# EasyEDA Pro project Amplifier Module D.eprj

# Schematic Schematic1
Create Date: 2024-02-14; Page Name: P1; Project Name: Amplifier Module D; Schematic Name: Schematic1; Update Date: 2024-05-11; Company: EasyEDA.com; Drawn: EasyEDA; Page Size: A4; Part Number: JLCPCB-002; Reviewed: EasyEDA; Version: V0.1
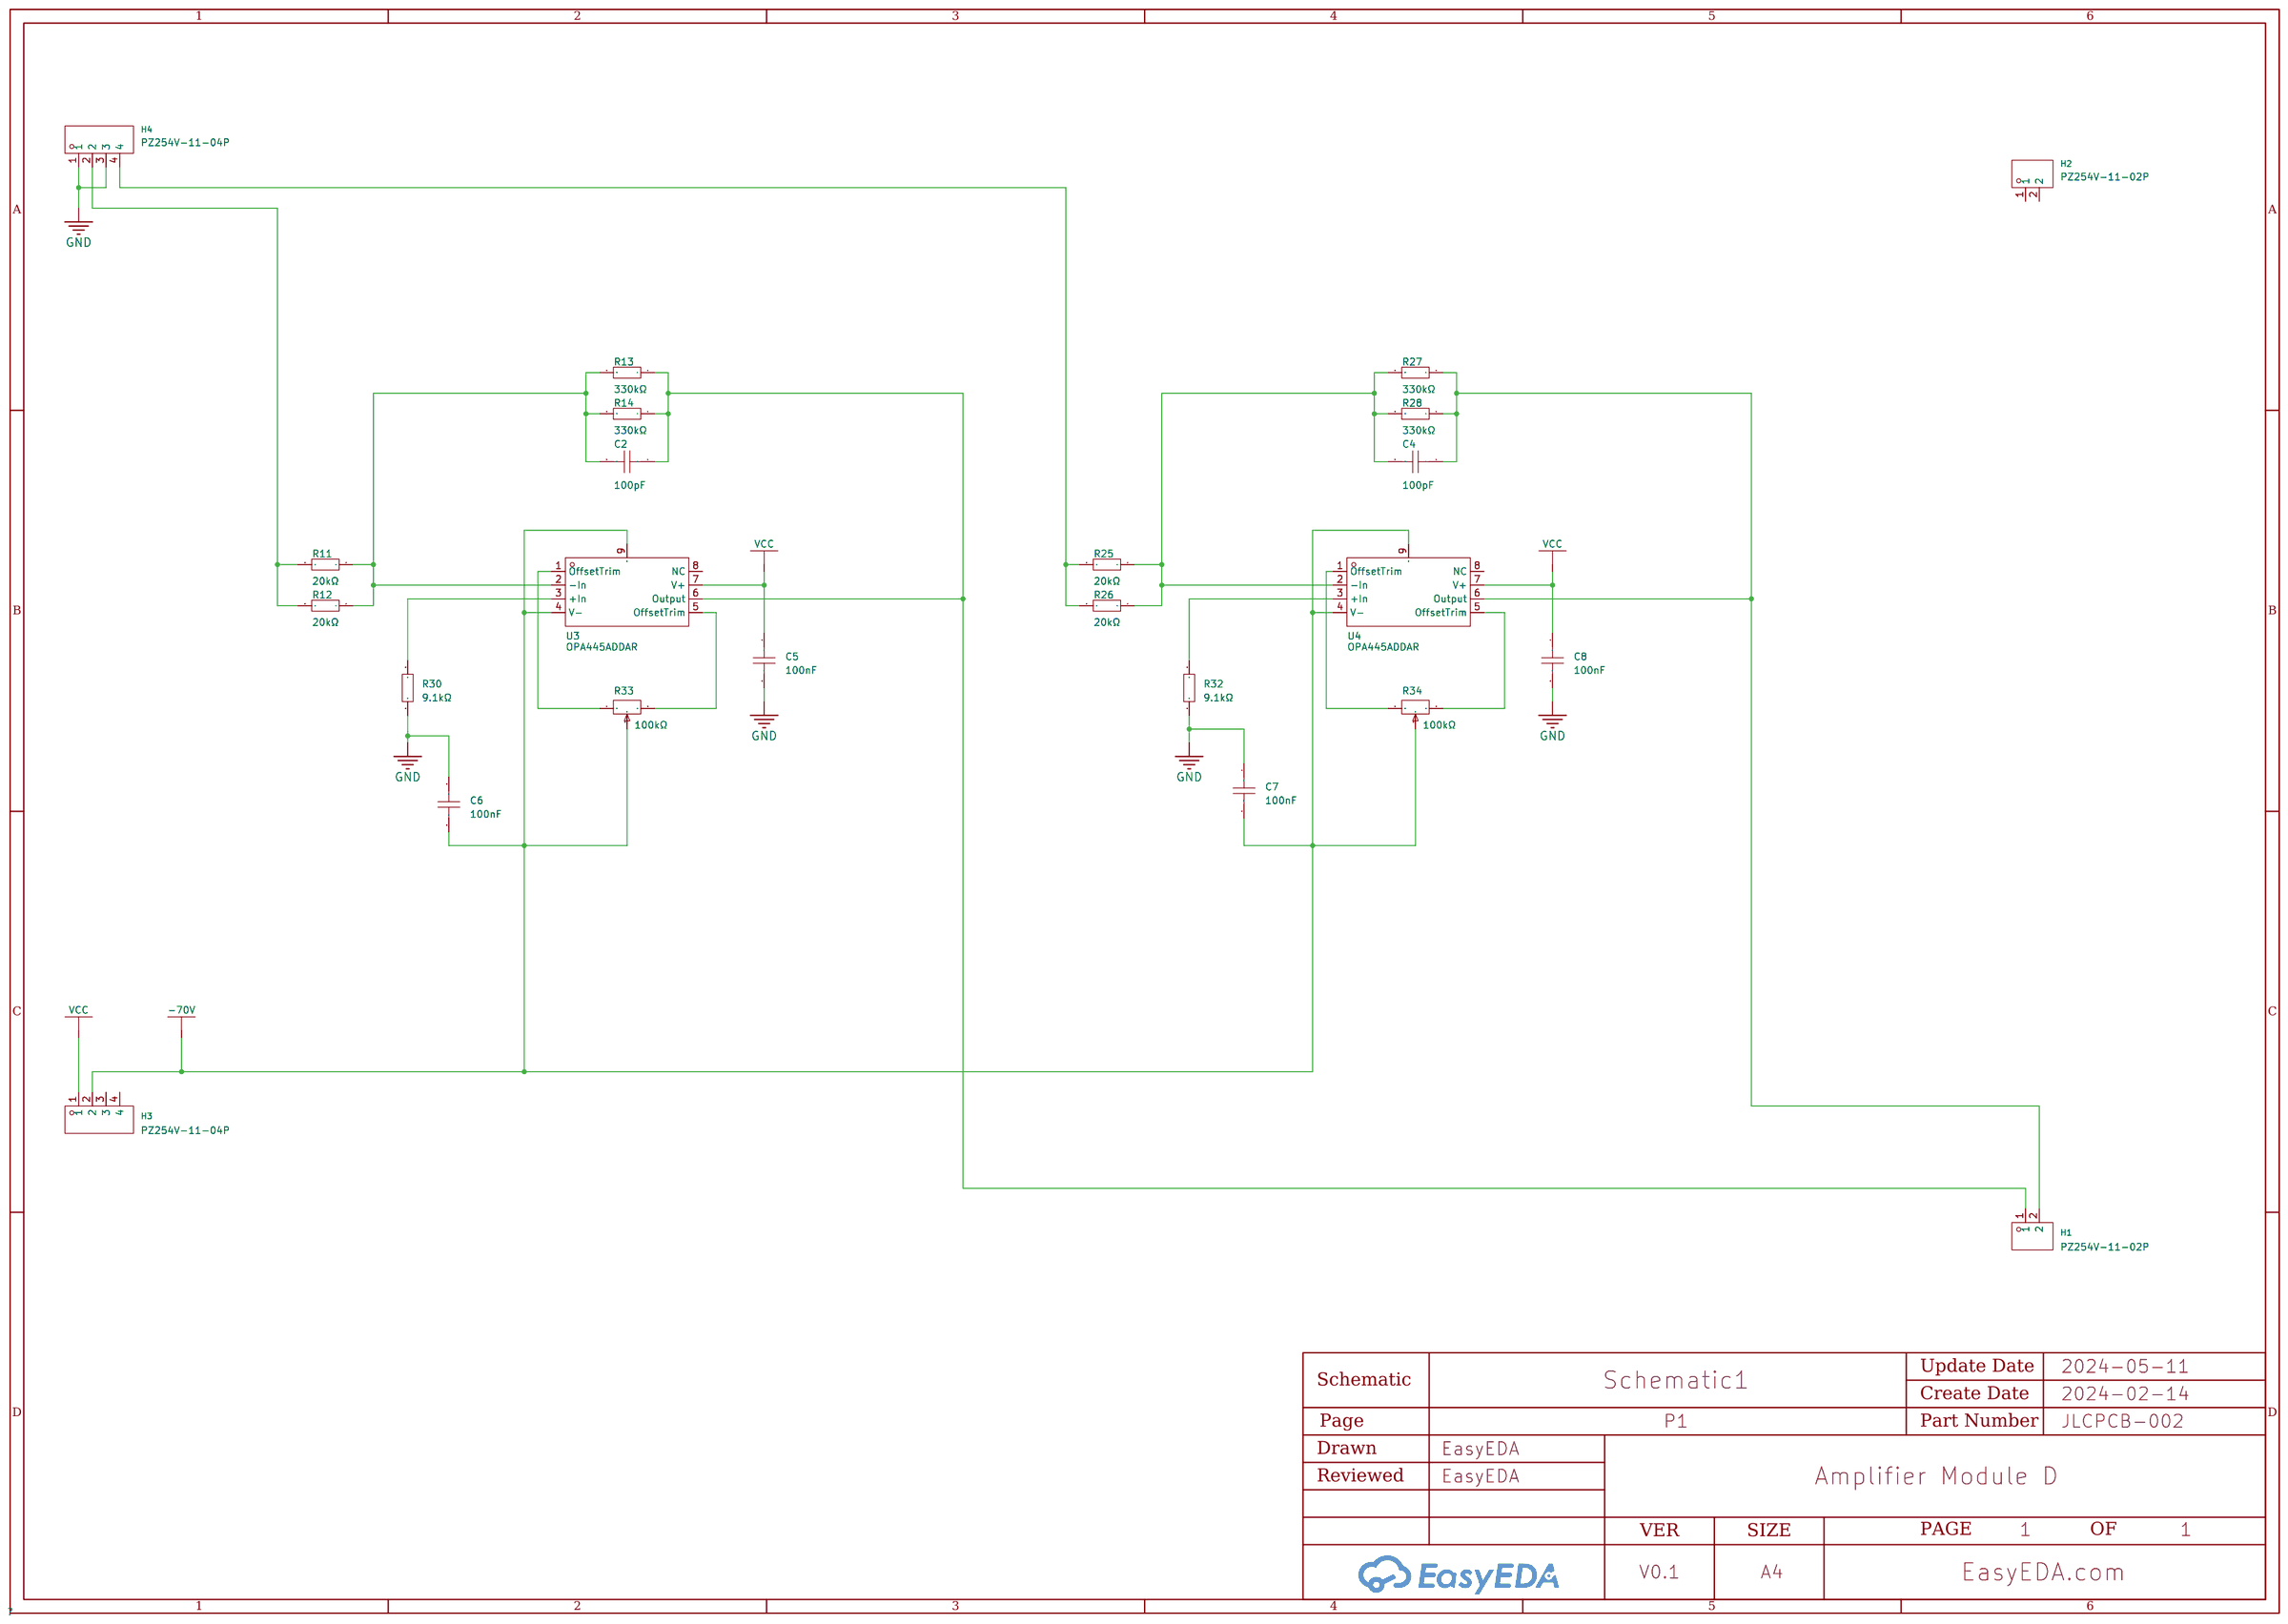
[diagram p0: schematic sheet]

## Parts
C2  100pF  [C0603]
C4  100pF  [C0603]
C5  100nF  [C0603]
C6  100nF  [C0603]
C7  100nF  [C0603]
C8  100nF  [C0603]
H1  PZ254V-11-02P  [HDR-TH_2P-P2.54-V-M]  (no BOM)
H2  PZ254V-11-02P  [HDR-TH_2P-P2.54-V-M]  (no BOM)
H3  PZ254V-11-04P  [HDR-TH_4P-P2.54-V-M]  (no BOM)
H4  PZ254V-11-04P  [HDR-TH_4P-P2.54-V-M]  (no BOM)
R11  20kΩ  [R0603]
R12  20kΩ  [R0603]
R13  330kΩ  [R0603]
R14  330kΩ  [R0603]
R25  20kΩ  [R0603]
R26  20kΩ  [R0603]
R27  330kΩ  [R0603]
R28  330kΩ  [R0603]
R30  9.1kΩ  [R0603]
R32  9.1kΩ  [R0603]
R33  100kΩ  [RES-ADJ-TH_3296W]  (no BOM)
R34  100kΩ  [RES-ADJ-TH_3296W]  (no BOM)
U3  OPA445ADDAR  [POWERPAD-SO-8_L4.9-W3.9-P1.27-LS6.0-BL-EP]
U4  OPA445ADDAR  [POWERPAD-SO-8_L4.9-W3.9-P1.27-LS6.0-BL-EP]

## Library data of the parts
C2 C4 = 0603CG101J101NT: Capacitance: Tolerance:±5% Tolerance:±5% Voltage Rated: Temperature Coefficient:; LCSC Part Name: 100pF ±5% 100V; Supplier Part: C44567; Manufacturer: FH(风华); Supplier Footprint: 0603; JLCPCB Part Class: Extended Part; Datasheet: https://atta.szlcsc.com/upload/public/pdf/source/20200305/C486355_26A10D38EF8C2A5C37091D0039909270.pdf; Supplier: LCSC; Tolerance: ±5%
C5-C8 = 0603B104K101NT: Capacitance:100nF Tolerance:±10% Tolerance:±10% Voltage Rated: Temperature Coefficient:; LCSC Part Name: 100nF ±10% 100V; Supplier Part: C88219; Manufacturer: FH(风华); Supplier Footprint: 0603; JLCPCB Part Class: Extended Part; Datasheet: https://atta.szlcsc.com/upload/public/pdf/source/20200305/C486355_26A10D38EF8C2A5C37091D0039909270.pdf; Supplier: LCSC; Tolerance: ±10%
H1 H2 = PZ254V-11-02P: Pin Structure:1x2P Pitch:2.54mm Row Spacing:- Circluar Pins/Square Pins:Square Pins Mounting Type:Straight Number of Rows:Plugin Number of Pins:2P Current Rating (Max):- Voltage Rating (Max):- Length of Mating Pin:6mm Insulation Height:2.5mm Length of End; LCSC Part Name: 间距:2.54mm 1x2P 直插 方针; Supplier Part: C492401; Manufacturer: XFCN(兴飞); Supplier Footprint: 插件,P=2.54mm; JLCPCB Part Class: Extended Part; Datasheet: https://atta.szlcsc.com/upload/public/pdf/source/20200309/C492401_A812433581A9B211A7FFA413ADDFF0E5.pdf; Supplier: LCSC; Pin Structure: 1x2P; Pitch: 2.54mm; Circluar Pins/Square Pins: Square Pins; Mounting Type: Straight; Number of Rows: Plugin; Number of Pins: 2P; Length of Mating Pin: 6mm; Insulation Height: 2.5mm; Length of End Connection Pin: 3mm; Operating Temperature Range: -40℃~+105℃; Color: Black
H3 H4 = PZ254V-11-04P: Pin Structure:1x4P Pitch:2.54mm Row Spacing:- Circluar Pins/Square Pins:Square Pins Mounting Type:Straight Number of Rows:Plugin Number of Pins:4P Current Rating (Max):3A Voltage Rating (Max):250V Length of Mating Pin:6mm Insulation Height:2.5mm Length of; LCSC Part Name: 间距:2.54mm 1x4P 直插 方针; Supplier Part: C2691448; Manufacturer: XFCN(兴飞); Supplier Footprint: 插件,P=2.54mm; JLCPCB Part Class: Extended Part; Datasheet: https://atta.szlcsc.com/upload/public/pdf/source/20200309/C492403_F9F19131791D08044AD4F84F8E751A34.pdf; Supplier: LCSC; Pin Structure: 1x4P; Pitch: 2.54mm; Circluar Pins/Square Pins: Square Pins; Mounting Type: Straight; Number of Rows: Plugin; Number of Pins: 4P; Current Rating (Max): 3A; Voltage Rating (Max): 250V; Length of Mating Pin: 6mm; Insulation Height: 2.5mm; Length of End Connection Pin: 3mm; Operating Temperature Range: -40℃~+105℃; Color: Black
R11 R12 R25 R26 = 0603WAF2002T5E: Type:Thick Film Resistors Resistance:20kΩ Tolerance:±1% Tolerance:±1% Power(Watts): Overload Voltage (Max): Temperature Coefficient:±100ppm/℃ Temperature Coefficient:±100ppm/℃ Operating Temperature Range:-55℃~+155℃ Operating Temperature Range:-55℃~+155℃; LCSC Part Name: 20kΩ ±1% 100mW 厚膜电阻; Supplier Part: C4184; Manufacturer: UNI-ROYAL(厚声); Supplier Footprint: 0603; JLCPCB Part Class: Basic Part; Datasheet: https://atta.szlcsc.com/upload/public/pdf/source/20200306/C422600_1E6D84923E4A46A82E41ADD87F860B5C.pdf; Supplier: LCSC; Type: Thick Film Resistors; Tolerance: ±1%; Temperature Coefficient: ±100ppm/℃; Operating Temperature Range: -55℃~+155℃
R13 R14 R27 R28 = 0603WAF3303T5E: Type:Thick Film Resistors Resistance:330kΩ Tolerance:±1% Tolerance:±1% Power(Watts): Overload Voltage (Max): Temperature Coefficient:±100ppm/℃ Temperature Coefficient:±100ppm/℃ Operating Temperature Range:-55℃~+155℃ Operating Temperature Range:-55℃~+155℃; LCSC Part Name: 330kΩ ±1% 100mW 厚膜电阻; Supplier Part: C23137; Manufacturer: UNI-ROYAL(厚声); Supplier Footprint: 0603; JLCPCB Part Class: Basic Part; Datasheet: https://atta.szlcsc.com/upload/public/pdf/source/20200306/C422600_1E6D84923E4A46A82E41ADD87F860B5C.pdf; Supplier: LCSC; Type: Thick Film Resistors; Tolerance: ±1%; Temperature Coefficient: ±100ppm/℃; Operating Temperature Range: -55℃~+155℃
R30 R32 = 0603WAF9101T5E: Type:Thick Film Resistors Resistance:9.1kΩ Tolerance:±1% Tolerance:±1% Power(Watts): Overload Voltage (Max): Temperature Coefficient:±100ppm/℃ Temperature Coefficient:±100ppm/℃ Operating Temperature Range:-55℃~+155℃ Operating Temperature Range:-55℃~+155℃; LCSC Part Name: 9.1kΩ ±1% 100mW 厚膜电阻; Supplier Part: C23260; Manufacturer: UNI-ROYAL(厚声); Supplier Footprint: 0603; JLCPCB Part Class: Basic Part; Datasheet: https://atta.szlcsc.com/upload/public/pdf/source/20200306/C422600_1E6D84923E4A46A82E41ADD87F860B5C.pdf; Supplier: LCSC; Type: Thick Film Resistors; Tolerance: ±1%; Temperature Coefficient: ±100ppm/℃; Operating Temperature Range: -55℃~+155℃
R33 R34 = 3296W-1-104LF: Resistance: Tolerance:±10% Tolerance:±10% Power(Watts): Temperature Coefficient:±100ppm/℃ Temperature Coefficient:±100ppm/℃ Turns:; LCSC Part Name: 100kΩ ±10%; Supplier Part: C48084; Manufacturer: BOURNS; Supplier Footprint: 插件; JLCPCB Part Class: Extended Part; Datasheet: https://atta.szlcsc.com/upload/public/pdf/source/20151026/1457707506403.pdf; Supplier: LCSC; Tolerance: ±10%; Temperature Coefficient: ±100ppm/℃
U3 U4 = OPA445ADDAR: Number of Circuits:单路 Gain Bandwidth Product(GBP):2MHz Current - Input Bias(Ib):10pA Slew Rate(SR):15V/us Output Current:15mA -3db Bandwidth:- Operating Temperature:-25℃~+85℃ Operating Temperature:-25℃~+85℃; Supplier Part: C1348607; Manufacturer: TI(德州仪器); Supplier Footprint: Power-Pad-SO-8; JLCPCB Part Class: Extended Part; Datasheet: https://www.ti.com/cn/lit/gpn/opa445; Supplier: LCSC; Number of Circuits: 单路; Gain Bandwidth Product(GBP): 2MHz; Current - Input Bias(Ib): 10pA; Slew Rate(SR): 15V/us; Output Current: 15mA; Operating Temperature: -25℃~+85℃

## Nets
-70V: C6.2 C7.2 H3.2 R33.2 R34.2 U3.4(V-) U3.9(EP) U4.4(V-) U4.9(EP)
GND: C5.2 C6.1 C7.1 C8.2 H4.1 H4.3 R30.1 R32.1
VCC: C5.1 C8.1 H3.1 U3.7(V+) U4.7(V+)
$1N1603: C2.2 R11.1 R12.1 R13.2 R14.2 U3.2(-In)
$1N4259: H4.2 R11.2 R12.2
$1N6394: H4.4 R25.2 R26.2
$1N18673: R30.2 U3.3(+In)
$1N21981: C2.1 H1.1 R13.1 R14.1 U3.6(Output)
$1N22006: R33.3 U3.5(OffsetTrim)
$1N22014: R33.1 U3.1(OffsetTrim)
$1N22193: C4.1 H1.2 R27.1 R28.1 U4.6(Output)
$1N22195: R34.3 U4.5(OffsetTrim)
$1N22199: R34.1 U4.1(OffsetTrim)
$1N22249: R32.2 U4.3(+In)
$1N22253: C4.2 R25.1 R26.1 R27.2 R28.2 U4.2(-In)

Not connected (* = marked no-connect by the designer): H2 1 2; H3 3 4; U3 8(NC); U4 8(NC)

# Board PCB1
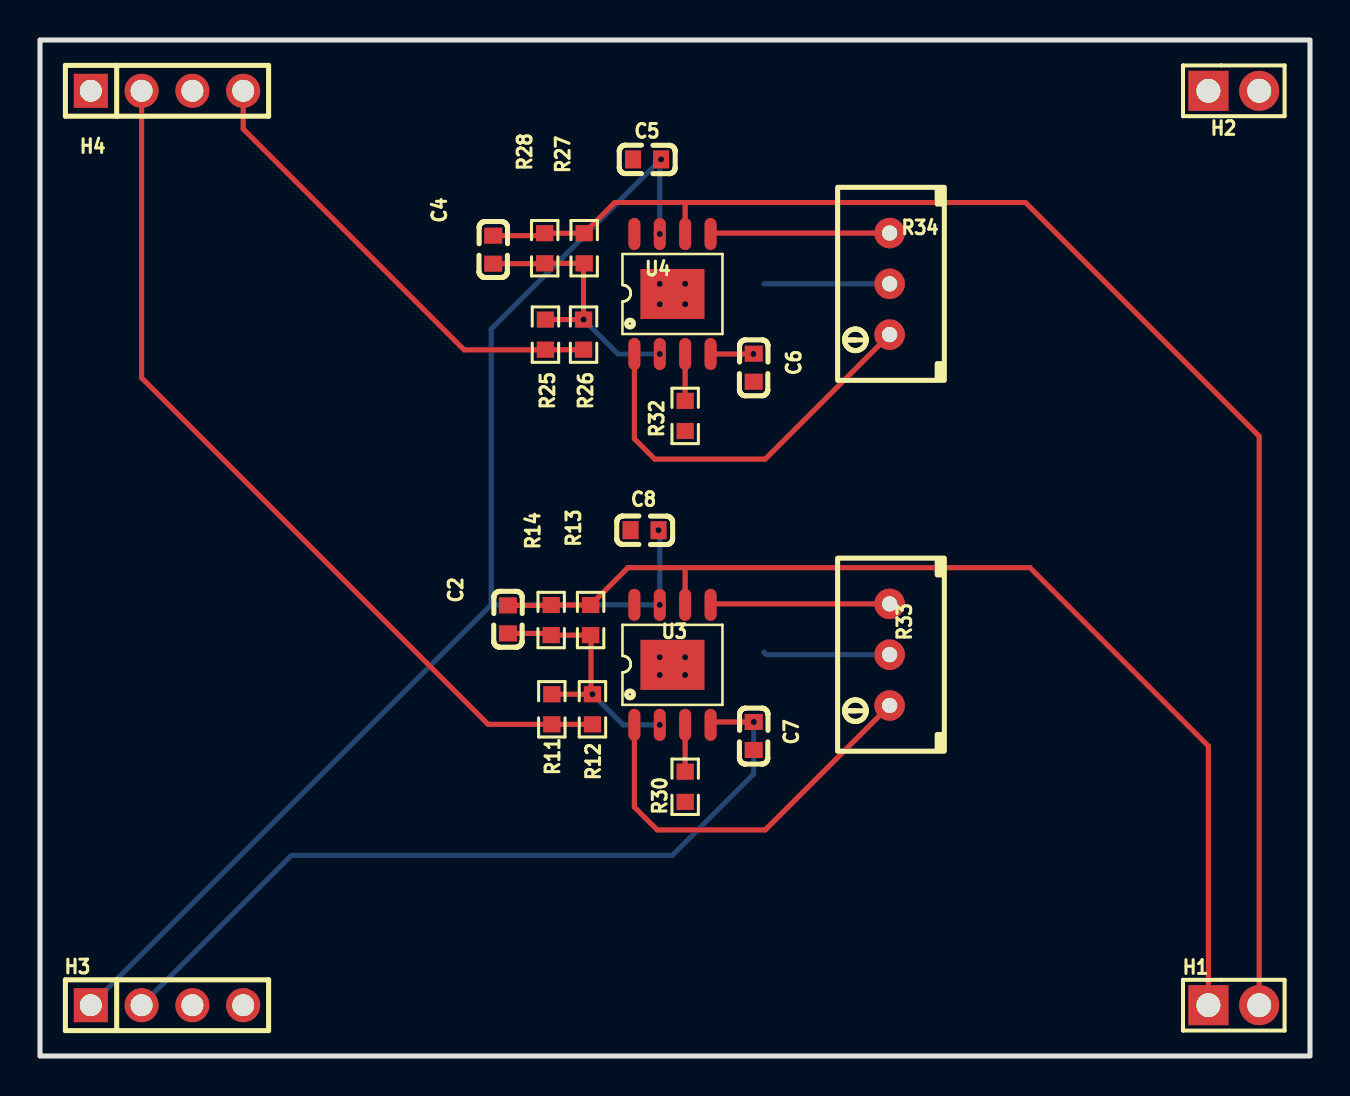
[diagram p1: board, top side]
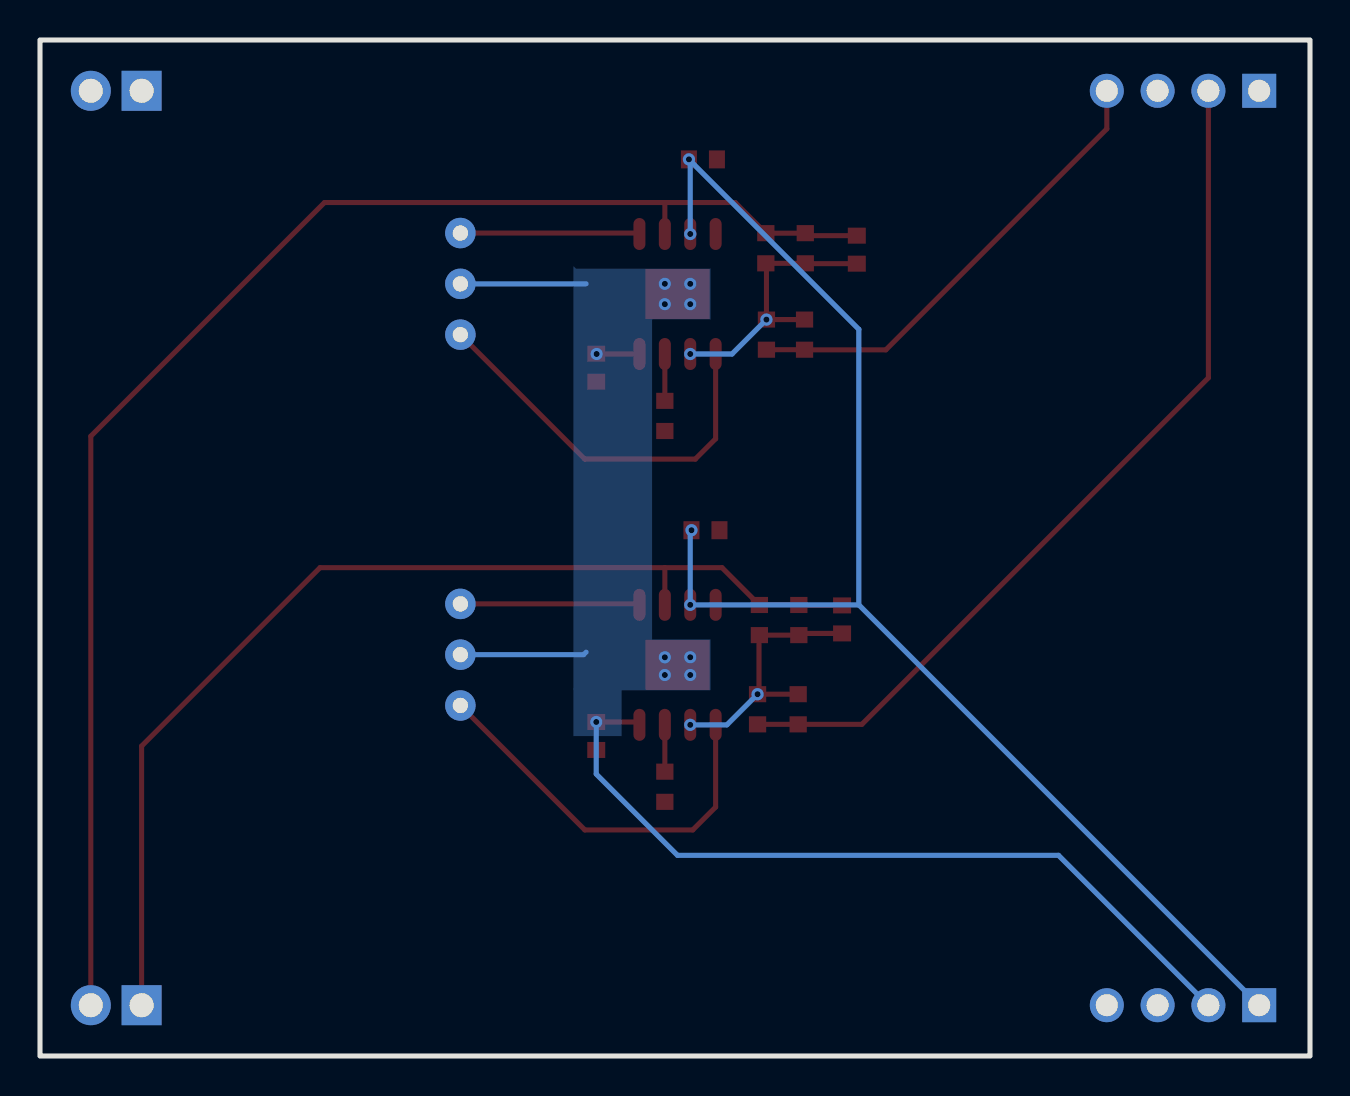
[diagram p2: board, bottom side, seen from below]

Outline 63.5 x 50.8 mm; copper layers: Top Layer, Bottom Layer. Coordinates in mm from the lower left corner of the outline.
Outline path: rectangle 0,50.8 63.5,0
Stack: Top Layer 0.035mm / Dielectric1 1.51mm FR4 er 4.5 / Bottom Layer 0.035mm

## Design rules (mm)
template: JLCPCB Capability(Two Layers Board)
spacing copperThickness1oz (default): track to track 0.102, other pairs 0.152 to 0.3
spacing copperThickness2oz: track to track 0.203, other pairs 0.152 to 0.3
track width copperThickness1oz (default): min 0.127, default 0.254, max 2.54
track width copperThickness2oz: min 0.203, default 0.254, max 2.54
differential pair differentialPair (default): width min 0.127, default 0.254, max 2.54; gap min 0.152, default 0.152
via viaSize (default): diameter min 0.5, default 0.61, max 10; hole min 0.3, default 0.305, max 6.3

## Placement (name value [footprint] x y rotation side)
C2  100pF  [C0603]  23.4 21.83 270 top
C4  100pF  [C0603]  22.66 40.32 270 top
C5  100nF  [C0603]  30.35 44.83 180 top
C6  100nF  [C0603]  35.69 34.42 90 top
C7  100nF  [C0603]  35.69 16 90 top
C8  100nF  [C0603]  30.23 26.29 180 top
H1  PZ254V-11-02P  [HDR-TH_2P-P2.54-V-M]  59.69 2.54 0 top
H2  PZ254V-11-02P  [HDR-TH_2P-P2.54-V-M]  59.69 48.26 0 top
H3  PZ254V-11-04P  [HDR-TH_4P-P2.54-V-M]  6.35 2.54 0 top
H4  PZ254V-11-04P  [HDR-TH_4P-P2.54-V-M]  6.35 48.26 0 top
R11  20kΩ  [R0603]  25.59 17.34 270 top
R12  20kΩ  [R0603]  27.62 17.34 270 top
R13  330kΩ  [R0603]  27.53 21.8 270 top
R14  330kΩ  [R0603]  25.56 21.8 270 top
R25  20kΩ  [R0603]  25.27 36.07 270 top
R26  20kΩ  [R0603]  27.18 36.07 270 top
R27  330kΩ  [R0603]  27.21 40.39 270 top
R28  330kΩ  [R0603]  25.24 40.39 270 top
R30  9.1kΩ  [R0603]  32.26 13.46 90 top
R32  9.1kΩ  [R0603]  32.26 32 90 top
R33  100kΩ  [RES-ADJ-TH_3296W]  42.48 20.07 180 top
R34  100kΩ  [RES-ADJ-TH_3296W]  42.48 38.61 180 top
U3  OPA445ADDAR  [POWERPAD-SO-8_L4.9-W3.9-P1.27-LS6.0-BL-EP]  31.62 19.56 0 top
U4  OPA445ADDAR  [POWERPAD-SO-8_L4.9-W3.9-P1.27-LS6.0-BL-EP]  31.62 38.1 0 top

## Footprints (pads in the part's own frame, mm; a bottom-side part is the same pattern mirrored in y, then rotated)
C0603
  rect 0.8x0.9 smd: 1(-0.7,0) 2(0.7,0)
HDR-TH_2P-P2.54-V-M
  rect 2x2 hole 1.2: 1(-1.27,0)
  round 2 hole 1.2: 2(1.27,0)
HDR-TH_4P-P2.54-V-M
  rect 1.7x1.7 hole 1.1: 1(-3.81,0)
  round 1.7 hole 1.1: 2(-1.27,0) 3(1.27,0) 4(3.81,0)
POWERPAD-SO-8_L4.9-W3.9-P1.27-LS6.0-BL-EP
  oval 0.6x1.6 smd: 1(-1.905,-3) 2(-0.635,-3) 3(0.635,-3) 4(1.905,-3) 5(1.905,3) 6(0.635,3) 7(-0.635,3) 8(-1.905,3)
  rect 3.2x2.5 smd: 9(0,0)
R0603
  rect 0.806x0.864 smd: 1(-0.753,0) 2(0.753,0)
RES-ADJ-TH_3296W
  round 1.524 hole 0.762: 1(0,2.54) 2(0,0) 3(0,-2.54)

## Nets
As in the schematic.

Pads without a net: H2 1 2; H3 3 4; U3 8; U4 8

## Via types
v1: diameter 0.61, hole 0.305, Top Layer to Bottom Layer, 18 vias

## Routing (per net, layer and track width the routed paths; a pad name or vN(x,y) marks a point on that pad's centre or on a via; arc(x,y) is an arc through that point)
-70V: length 55.1
  Top Layer w0.254: U4.4 v1(35.67,35.1) C6.2 ; 35.69,16.76 v1(35.69,16.7) 33.67,16.7 U3.4
  Bottom Layer w0.254: 36.19,20.19 36.32,20.07 R33.2 ; H3.2 12.57,10.03 31.62,10.03 35.69,14.1 v1(35.69,16.7) ; R34.2 36.19,38.61
  vias: v1(30.99,38.61) v1(30.99,37.59) v1(30.99,19.94) v1(30.99,19.05) v1(32.26,38.61) v1(32.26,37.59) v1(32.26,19.94) v1(32.26,19.05)
VCC: length 70
  Bottom Layer w0.254: H3.1 22.56,22.56 ; 22.56,22.56 v1(30.99,22.56) 30.99,26.23 v1(30.93,26.29) ; 22.56,22.56 22.56,36.34 30.99,44.77 ; v1(30.99,41.1) 30.99,44.77 ; 30.99,44.77 v1(31.05,44.83)
$1N1603: length 13
  Top Layer w0.254: C2.2 25.47,21.13 R14.2 R13.2 27.55,21.03 27.55,18.09 ; 27.55,18.09 25.72,18.09 ; 27.55,18.09 v1(27.62,18.09)
  Bottom Layer w0.254: v1(27.62,18.09) 29.15,16.56 v1(30.99,16.56)
$1N4259: length 43.9
  Top Layer w0.254: R11.2 22.41,16.58 5.08,33.91 H4.2 ; 25.72,16.58 R12.2
$1N6394: length 23.6
  Top Layer w0.254: R26.2 25.4,35.31 25.53,35.19 ; R25.2 25.26,35.31 21.21,35.31 10.16,46.36 H4.4
$1N18673: length 2.6
  Top Layer w0.254: R30.2 32.26,16.84
$1N21981: length 54.6
  Top Layer w0.254: H1.1 58.42,15.49 49.5,24.42 32.26,24.42 ; 32.26,24.42 29.4,24.42 R13.1 R14.1 25.54,22.53 C2.1 ; 32.26,24.42 32.26,22.28
$1N22006: length 9
  Top Layer w0.254: R33.3 33.58,22.61 U3.5
$1N22014: length 19.9
  Top Layer w0.254: R33.1 36.26,11.3 30.86,11.3 29.72,12.45 U3.1
$1N22193: length 73.8
  Top Layer w0.254: 32.26,42.67 28.74,42.67 R27.1 R28.1 25.11,41.02 C4.1 ; 32.26,42.67 U4.6 ; 32.26,42.67 49.28,42.67 60.96,30.99 H1.2
$1N22195: length 9
  Top Layer w0.254: R34.3 33.58,41.15 U4.5
$1N22199: length 20
  Top Layer w0.254: U4.1 29.72,30.86 30.73,29.84 36.26,29.84 R34.1
$1N22249: length 2.3
  Top Layer w0.254: U4.3 R32.2
$1N22253: length 13.7
  Top Layer w0.254: 25.4,36.82 v1(27.18,36.82) 27.18,39.6 R27.2 R28.2 25.22,39.62 C4.2
  Bottom Layer w0.254: v1(27.18,36.82) 28.9,35.1 v1(30.99,35.1)

## Copper pours and planes (outline as drawn; the poured copper is in the pictures)
-70V on Bottom Layer: 34.42,18.42 36.83,18.42 36.83,15.99 34.42,15.99
-70V on Bottom Layer: 29.97,39.5 36.83,39.5 36.83,18.29 29.97,18.29
GND on Top Layer: 0.25,50.55 63.25,50.55 63.25,0.25 0.25,0.25
GND on Bottom Layer: 0.25,50.55 63.25,50.55 63.25,0.25 0.25,0.25
